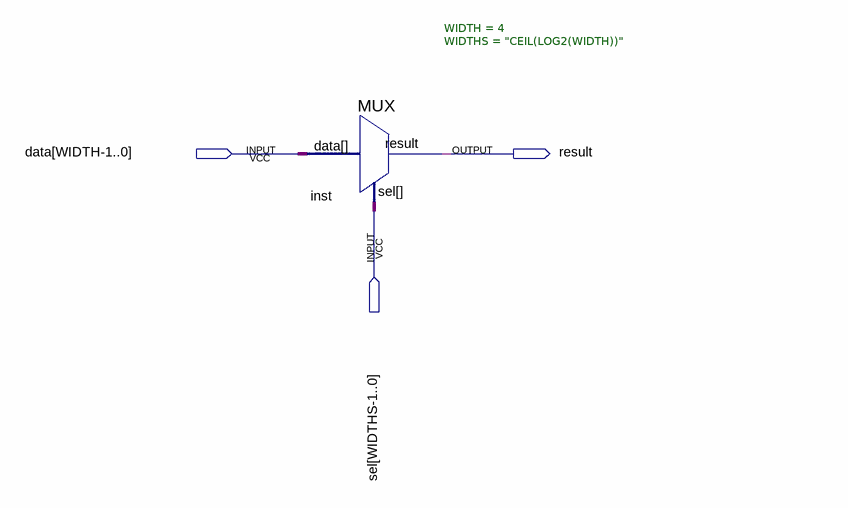
[diagram p0: schematic sheet]
// Quartus schematic Mux2.bdf as structural Verilog: 1 symbols, 3 pins
module Mux2 (
  input  \data[WIDTH-1..0] ,
  input  \sel[WIDTHS-1..0] ,
  output result
);

  wire [3:0] undriven;

  MUX #(.WIDTH(4), .WIDTHS("CEIL(LOG2(WIDTH))")) inst (.data(undriven), .sel(\sel[WIDTHS-1..0] ), .result(result));
endmodule
